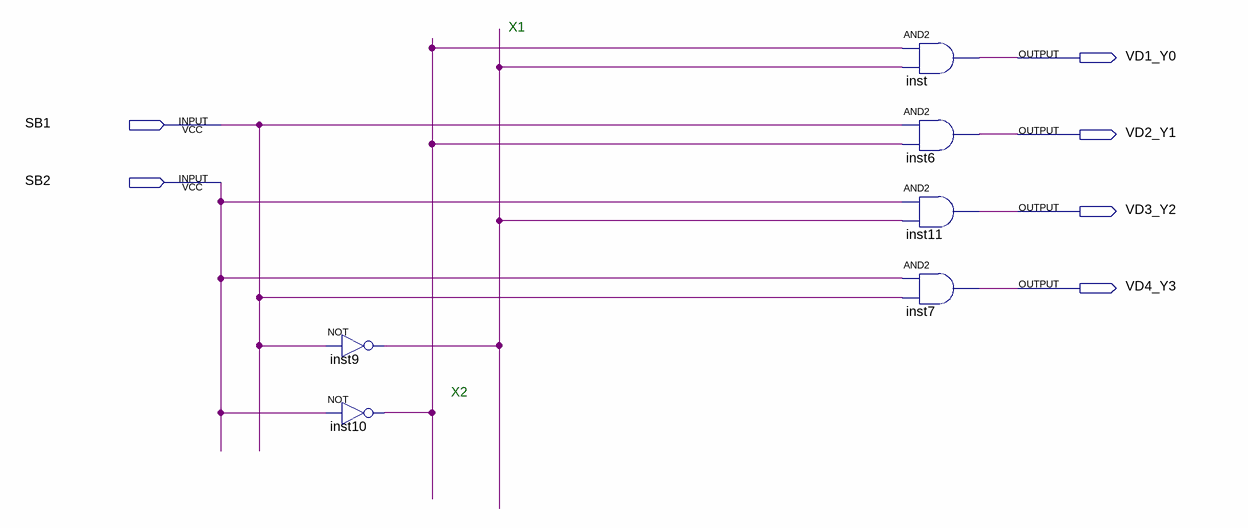
[diagram p0: schematic sheet]
// Quartus schematic work_5.bdf as structural Verilog: 6 symbols, 6 pins
module work_5 (
  input  SB1,
  input  SB2,
  output VD1_Y0,
  output VD2_Y1,
  output VD3_Y2,
  output VD4_Y3
);

  wire inst9_out, inst10_out;

  not inst9 (inst9_out, SB1);
  not inst10 (inst10_out, SB2);
  and inst (VD1_Y0, inst10_out, inst9_out);
  and inst6 (VD2_Y1, SB1, inst10_out);
  and inst11 (VD3_Y2, SB2, inst9_out);
  and inst7 (VD4_Y3, SB2, SB1);

  // Notes on the sheet:
  //   X1
  //   X2
endmodule
